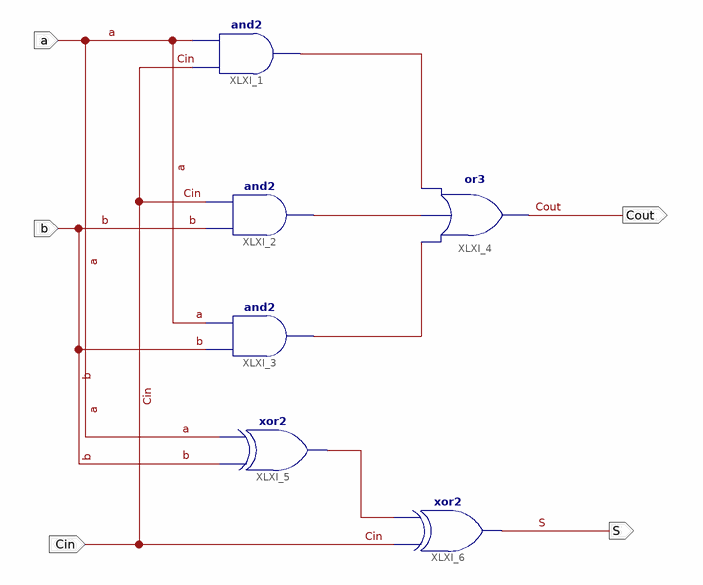
[diagram p0: schematic sheet 1]
// Xilinx ISE schematic mux.sch (spartan3e) as structural Verilog: 6 symbols, 5 ports
module mux (
  input  Cin,
  input  a,
  input  b,
  output Cout,
  output S
);

  wire XLXN_1, XLXN_2, XLXN_3, XLXN_4;

  and XLXI_1 (XLXN_1, Cin, a);
  and XLXI_2 (XLXN_2, b, Cin);
  and XLXI_3 (XLXN_3, b, a);
  or XLXI_4 (Cout, XLXN_3, XLXN_2, XLXN_1);
  xor XLXI_5 (XLXN_4, b, a);
  xor XLXI_6 (S, Cin, XLXN_4);
endmodule
